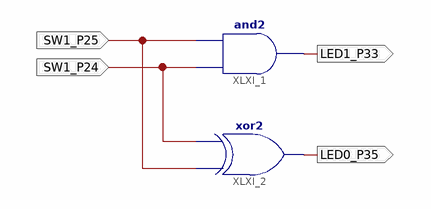
[diagram p0: schematic sheet 1]
// Xilinx ISE schematic HalfAdder.sch (spartan6) as structural Verilog: 2 symbols, 4 ports
module HalfAdder (
  input  SW1_P24,
  input  SW1_P25,
  output LED1_P33,
  output LED0_P35
);

  and XLXI_1 (LED1_P33, SW1_P24, SW1_P25);
  xor XLXI_2 (LED0_P35, SW1_P25, SW1_P24);
endmodule
